# Altium project MiniSub_Power_Board.PrjPcb
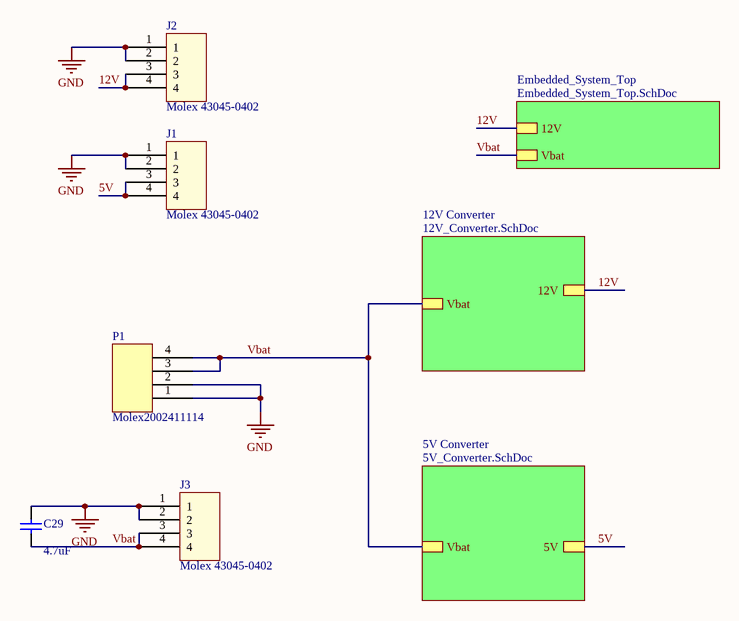
[diagram p0: MiniSub_Power_Board.SchDoc]
6 sheets, 96 parts. Net scope: hierarchical (ports join the sheet entries above them; power ports are global).
Board file: MiniSub_Power_Board.PcbDoc
Sheets:
  MiniSub_Power_Board.SchDoc
    12V Converter = 12V_Converter.SchDoc
    5V Converter = 5V_Converter.SchDoc
    Embedded_System_Top = Embedded_System_Top.SchDoc
      Embedded_Chip = Embedded_Chip.SchDoc
      Embedded Circuits = Embedded_Circuits.SchDoc

## Sheet MiniSub_Power_Board.SchDoc
size A

### Parts
C29  value 4.7uF  [C1210]  (hidden comment: HMK325C7475KN-TE)
J1  Molex 43045-0402  [Molex43045-0402]
J2  Molex 43045-0402  [Molex43045-0402]
J3  Molex 43045-0402  [Molex43045-0402]
P1  Molex2002411114  [Molex2002411114]

### Sub-sheets
5V Converter = 5V_Converter.SchDoc: Vbat, 5V
12V Converter = 12V_Converter.SchDoc: Vbat, 12V
Embedded_System_Top = Embedded_System_Top.SchDoc: 12V, Vbat

### Nets
GND: C29.2 J1.1 J1.2 J2.1 J2.2 J3.1 J3.2 P1.1 P1.2
5V: J1.3 J1.4 ; sheet 5V Converter/5V
12V: J2.3 J2.4 ; sheet 12V Converter/12V, sheet Embedded_System_Top/12V
Vbat: C29.1 J3.3 J3.4 P1.3 P1.4 ; sheet 12V Converter/Vbat, sheet 5V Converter/Vbat, sheet Embedded_System_Top/Vbat

### Library data of the parts
C29 = Cap Semi: Capacitor (Semiconductor SIM Model); Published: 8-Jun-2000; LatestRevisionDate: 29-May-2009; LatestRevisionNote: IPC-7351 Footprint Added.; PackageReference: C1206; Publisher: Altium Limited; PackageDescription: Chip Capacitor; ComponentLink1Description: Datasheet; ComponentLink1URL: https://www.yuden.co.jp/productdata/catalog/mlcc06_e.pdf; ComponentLink2Description: Digi-Key; ComponentLink2URL: https://www.digikey.com/product-detail/en/taiyo-yuden/HMK325C7475KN-TE/587-5038-1-ND/6563881
J1-J3 = Molex43045-0402: Micro-Fit 3.0 Right Angle Header, 3.00mm Pitch, Dual Row, 4 Circuits, with Snap-in Plastic Peg PCB Lock, Gold, Glow Wire Capable, Black; ComponentLink1Description: Molex Website; ComponentLink1URL: https://www.molex.com/molex/products/datasheet.jsp?part=active/0430450402_PCB_HEADERS.xml

## Sheet 12V_Converter.SchDoc
size A
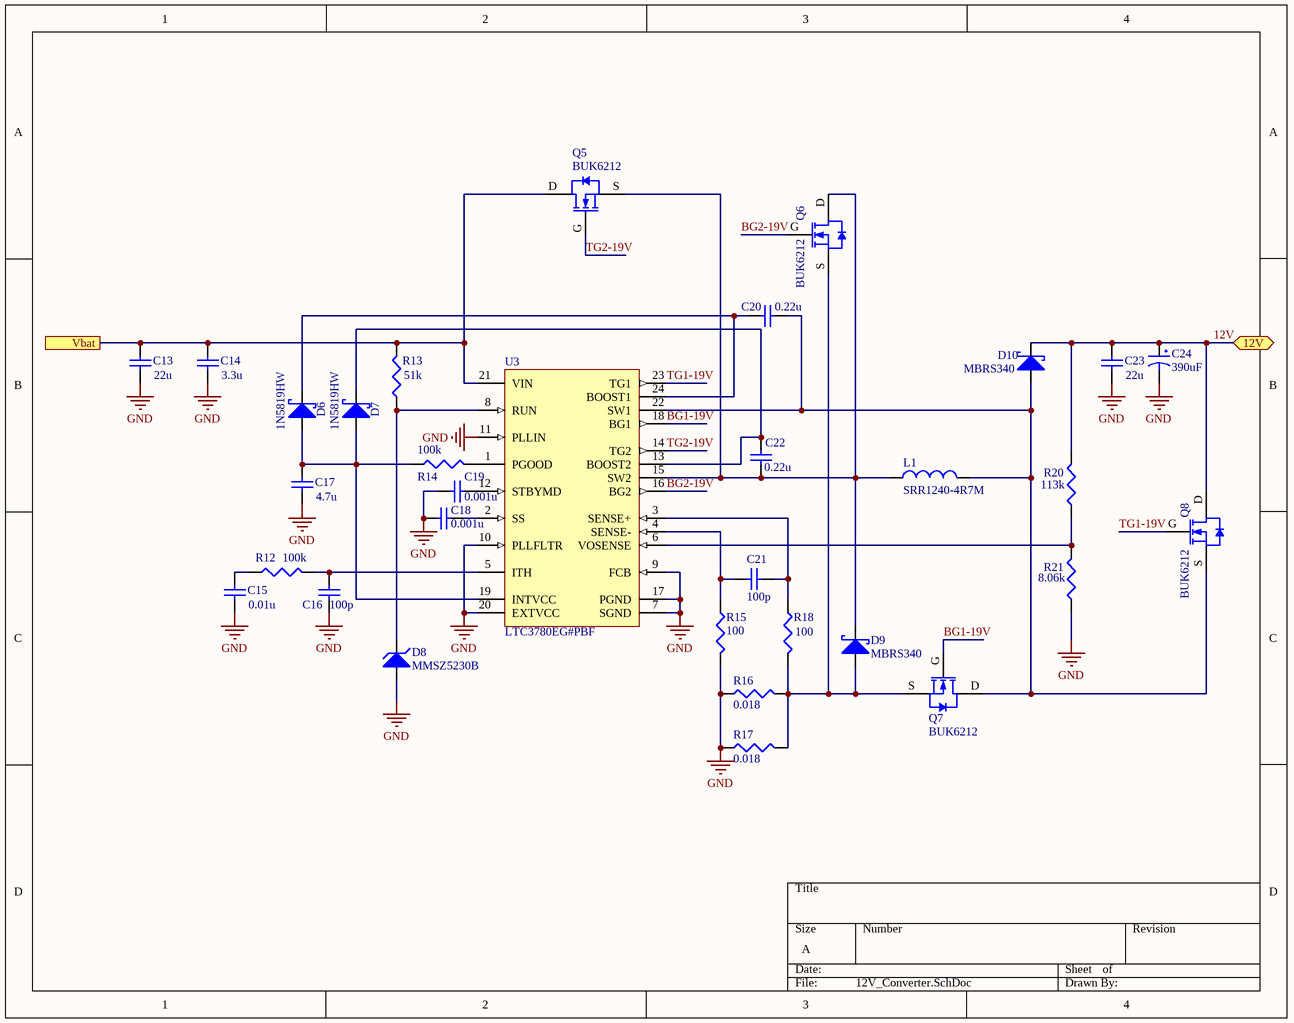
[diagram p1: 12V_Converter.SchDoc]

### Parts
C13  value 22u  [C1206]  (hidden comment: Cap Semi)
C14  value 3.3u  [C1206]  (hidden comment: Cap Semi)
C15  value 0.01u  [C1206]  (hidden comment: Cap Semi)
C16  value 100p  [C1206]  (hidden comment: Cap Semi)
C17  value 4.7u  [C1206]  (hidden comment: Cap Semi)
C18  value 0.001u  [C1206]  (hidden comment: Cap Semi)
C19  value 0.001u  [C1206]  (hidden comment: Cap Semi)
C20  value 0.22u  [C1206]  (hidden comment: Cap Semi)
C21  value 100p  [C1206]  (hidden comment: Cap Semi)
C22  value 0.22u  [C1206]  (hidden comment: Cap Semi)
C23  value 22u  [C1206]  (hidden comment: Cap Semi)
C24  390uF  [PCVxxxxxMCLxGS]
D6  1N5819HW  [1N58xx]
D7  1N5819HW  [1N58xx]
D8  MMSZ5230B  [ONSC-SOD-123-2-425-04_V]
D9  MBRS340  [MBRS340]
D10  MBRS340  [MBRS340]
L1  SRR1240-4R7M  [SRR1240]
Q5  BUK6212  [NXP-SOT428_M]
Q6  BUK6212  [NXP-SOT428_M]
Q7  BUK6212  [NXP-SOT428_M]
Q8  BUK6212  [NXP-SOT428_M]
R12  value 100k  [J1-0603]  (hidden comment: Res3)
R13  value 51k  [J1-0603]  (hidden comment: Res3)
R14  value 100k  [J1-0603]  (hidden comment: Res3)
R15  value 100  [J1-0603]  (hidden comment: Res3)
R16  value 0.018  [R1206]  (hidden comment: Res3)
R17  value 0.018  [R1206]  (hidden comment: Res3)
R18  value 100  [J1-0603]  (hidden comment: Res3)
R20  value 113k  [J1-0603]  (hidden comment: Res3)
R21  value 8.06k  [J1-0603]  (hidden comment: Res3)
U3  LTC3780EG#PBF  [LT-G-24_L]

### Ports
12V (bidir), Vbat

### Nets
GND: C13.1 C14.1 C15.1 C16.1 C17.1 C18.1 C19.1 C23.1 C24.2 D8.2(A) R15.2 R16.1 R17.1 R21.1 U3.7(SGND) U3.9(FCB) U3.10(PLLFLTR) U3.11(PLLIN) U3.17(PGND) U3.20(EXTVCC)
12V: C23.2 C24.1 D10.K(Cathode) Q8.D R20.2 ; port 12V
BG1-19V: Q7.G U3.18(BG1)
BG2-19V: Q6.G U3.16(BG2)
TG1-19V: Q8.G U3.23(TG1)
TG2-19V: Q5.G U3.14(TG2)
Vbat: C13.2 C14.2 Q5.D R13.2 U3.21(VIN) ; port Vbat
NetC15_2: C15.2 R12.1
NetC16_2: C16.2 R12.2 U3.5(ITH)
NetC17_2: C17.2 D6.A(Anode) D7.A(Anode) R14.1 U3.19(INTVCC)
NetC18_2: C18.2 U3.2(SS)
NetC19_2: C19.2 U3.12(STBYMD)
NetC20_1: C20.1 D10.A(Anode) L1.2 Q7.D Q8.S U3.22(SW1)
NetC20_2: C20.2 D6.K(Cathode) U3.24(BOOST1)
NetC21_1: C21.1 R15.1 U3.4(SENSE-)
NetC21_2: C21.2 R18.1 U3.3(SENSE+)
NetC22_1: C22.1 D9.K(Cathode) L1.1 Q5.S Q6.D U3.15(SW2)
NetC22_2: C22.2 D7.K(Cathode) U3.13(BOOST2)
NetD8_1: D8.1(K) R13.1 U3.8(RUN)
NetD9_A: D9.A(Anode) Q6.S Q7.S R16.2 R17.2 R18.2
NetR14_2: R14.2 U3.1(PGOOD)
NetR20_1: R20.1 R21.2 U3.6(VOSENSE)

### Library data of the parts
C13-C23 = Cap Semi: Capacitor (Semiconductor SIM Model); Published: 8-Jun-2000; LatestRevisionDate: 29-May-2009; LatestRevisionNote: IPC-7351 Footprint Added.; PackageReference: C1206; Publisher: Altium Limited; PackageDescription: Chip Capacitor
C24 = PCV1E391MCL2GS: CAP ALUM POLY 390UF 20% 25V SMD; Digikey: https://www.digikey.com/product-detail/en/nichicon/PCV1E391MCL2GS/493-4544-1-ND/2786841; Datasheet: http://nichicon-us.com/english/products/pdfs/e-pcv.pdf
D6 D7 = 1N58xx: 1A Schottky Barrier Rectifier Diode; Datasheet: http://www.kesenes.com/pdf/1n5817-1n5819.pdf
D8 = MMSZ5230BT1G: Zener Voltage Regulator, 500 mW, 2-Pin SOD-123, Pb-Free, Tape and Reel; Manufacturer: On Semiconductor; P Max (W): 0.5; VZ Typ (V): 4.7; DatasheetVersion: Rev. 12; PackageVersion: Rev. G, 10/2009; PackageReference: SOD-123-2-425-04; PackageDescription: 2-Pin SOD, Body 1.6 x 2.69 mm; Supplier 1: Digi-Key; Supplier Part Number 1: MMSZ5230BT1GOSTR-ND; Supplier 2: Digi-Key; Supplier Part Number 2: MMSZ5230BT1GOSCT-ND; Supplier 3: Digi-Key; Supplier Part Number 3: MMSZ5230BT1GOSDKR-ND; Supplier 4: Farnell; Supplier Part Number 4: 1431272; Supplier 5: Farnell; Supplier Part Number 5: 1431272RL; Supplier 6: Farnell; Supplier Part Number 6: 2370826; Supplier 7: Newark; Supplier Part Number 7: 83H7423; Supplier 8: Newark; Supplier Part Number 8: 67R1368; Supplier 9: Mouser; Supplier Part Number 9: 863-MMSZ5230BT1G; Packing: Tape and Reel; RoHS: Pb-Free; Mounting Technology: Surface Mount; PartNumber: MMSZ5230BT1G; ComponentLink1Description: Manufacturer URL; ComponentLink1URL: http://www.onsemi.com/; ComponentLink2Description: Datasheet; ComponentLink2URL: http://www.onsemi.com/pub_link/Collateral/MMSZ5221BT1-D.PDF; ComponentLink3Description: Package Specification; ComponentLink3URL: http://www.onsemi.com/pub_link/Collateral/425-04.PDF
D9 D10 = MBRS340: Schottky Rectifier; Datasheet: https://www.mouser.com/ds/2/308/MBRS340-1120985.pdf
L1 = SRR1240: FIXED IND 4.7UH 6A 18 MOHM SMD; Digikey: https://www.digikey.com/product-detail/en/bourns-inc/SRR1240-4R7M/SRR1240-4R7MCT-ND/2127398; Datasheet: https://www.bourns.com/docs/Product-Datasheets/SRR1240.pdf
Q5-Q8 = BUK6212: N-Channel TrenchMOS Intermediate Level FET, 40 V, 50 A, 3-Pin SOT428, Tape and Reel; Manufacturer: NXP Semiconductors; PartNumber: BUK6212-40C,118; Automotive Qualified: Y; Channel Type: N; ID [max] (A): 50; IDM [max] (A): 233; Packing: Tape & Reel; Qr [typ] (nC): 38; VDS [max] (V): 40; VGSth [typ] (V): 2.3; DatasheetVersion: Rev. 2; PackageVersion: 14-06-10, 06/2014; PackageReference: SOT428; PackageDescription: 3-Pin Plastic Single-ended Surface Mounted Package, Body 6.1 x 6.6 mm, Pitch 2.285 mm; Supplier 1: Digi-Key; Supplier Part Number 1: 568-6983-2-ND; Supplier 2: Digi-Key; Supplier Part Number 2: 568-6983-1-ND; Supplier 3: Digi-Key; Supplier Part Number 3: 568-6983-6-ND; Supplier 4: Mouser; Supplier Part Number 4: 771-BUK621240C118; Mounting Technology: Surface Mount; Code_JEITA: SC-63; Code_JEDEC: TO-252; ComponentLink1Description: Manufacturer URL; ComponentLink1URL: http://www.nxp.com/; ComponentLink2Description: Datasheet; ComponentLink2URL: http://www.nxp.com/documents/data_sheet/BUK6212-40C.pdf; ComponentLink3Description: Package Specification; ComponentLink3URL: http://www.nxp.com/documents/outline_drawing/sot428_po.pdf
R12-R18 R20 R21 = Res3: Resistor; Published: 8-Jun-2000; LatestRevisionDate: 29-May-2009; LatestRevisionNote: IPC-7351 Footprint Added.; PackageReference: J1-0603; Publisher: Altium Limited; PackageDescription: Chip Resistor
U3 = LTC3780EG#PBF: Buck-boost Controller, Constant Frequency, Current Mode Control with Power Good Output, 24-pin SOP (G-24), -40 to 85 degC, Pb-Free; Manufacturer: Linear Technology; Frequency Sync Range: 200kHz - 400kHz; Number of Outputs: 1; DatasheetVersion: Rev. F; PackageVersion: Jun-10; PackageReference: G-24; PackageDescription: 24-Pin Plastic SSOP, Body 8.2 x 5.3 mm, Pitch 0.65 mm; Supplier 1: Digi-Key; Supplier Part Number 1: LTC3780EG#PBF-ND; Supplier 2: Farnell; Supplier Part Number 2: 1273545; Supplier 3: Newark; Supplier Part Number 3: 56M8395; RoHS: TRUE; Mounting Technology: Surface Mount; PartNumber: LTC3780EG#PBF; ComponentLink1Description: Manufacturer URL; ComponentLink1URL: http://www.linear.com/; ComponentLink2Description: Datasheet; ComponentLink2URL: http://cds.linear.com/docs/en/datasheet/3780ff.pdf; ComponentLink3Description: Package Specification; ComponentLink3URL: http://cds.linear.com/docs/en/packaging/SSOP_24_05-08-1640.pdf

## Sheet 5V_Converter.SchDoc
size A
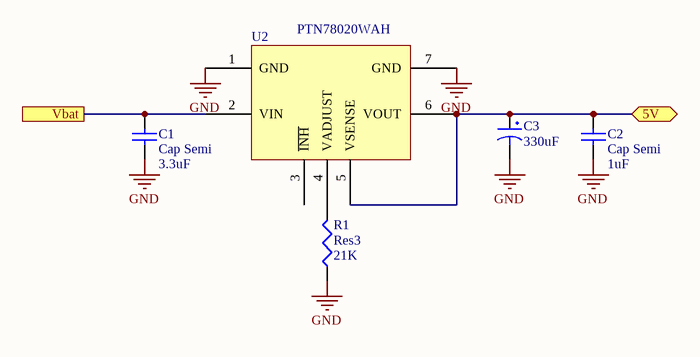
[diagram p2: 5V_Converter.SchDoc]

### Parts
C1  Cap Semi  value 3.3uF  [C1206]
C2  Cap Semi  value 1uF  [C1206]
C3  330uF  [PCVxxxxxMCLxGS]
R1  Res3  value 21K  [J1-0603]
U2  PTN78020WAH  [PTN78020WAH]

### Ports
5V (bidir), Vbat

### Nets
GND: C1.1 C2.1 C3.2 R1.1 U2.1(GND) U2.7(GND)
5V: C2.2 C3.1 U2.5(VSENSE) U2.6(VOUT) ; port 5V
Vbat: C1.2 U2.2(VIN) ; port Vbat
NetR1_2: R1.2 U2.4(VADJUST)

Not connected (* = marked no-connect by the designer): U2 3(~{INH})

### Library data of the parts
C1 C2 = Cap Semi: Capacitor (Semiconductor SIM Model); Published: 8-Jun-2000; LatestRevisionDate: 29-May-2009; LatestRevisionNote: IPC-7351 Footprint Added.; PackageReference: C1206; Publisher: Altium Limited; PackageDescription: Chip Capacitor
C3 = PCV1E391MCL2GS: CAP ALUM POLY 390UF 20% 25V SMD; Digikey: https://www.digikey.com/product-detail/en/nichicon/PCV1E391MCL2GS/493-4544-1-ND/2786841; Datasheet: http://nichicon-us.com/english/products/pdfs/e-pcv.pdf
R1 = Res3: Resistor; Published: 8-Jun-2000; LatestRevisionDate: 29-May-2009; LatestRevisionNote: IPC-7351 Footprint Added.; PackageReference: J1-0603; Publisher: Altium Limited; PackageDescription: Chip Resistor
U2 = PTN78020WAH: 6A DC DC Converter

## Sheet Embedded_System_Top.SchDoc
size A
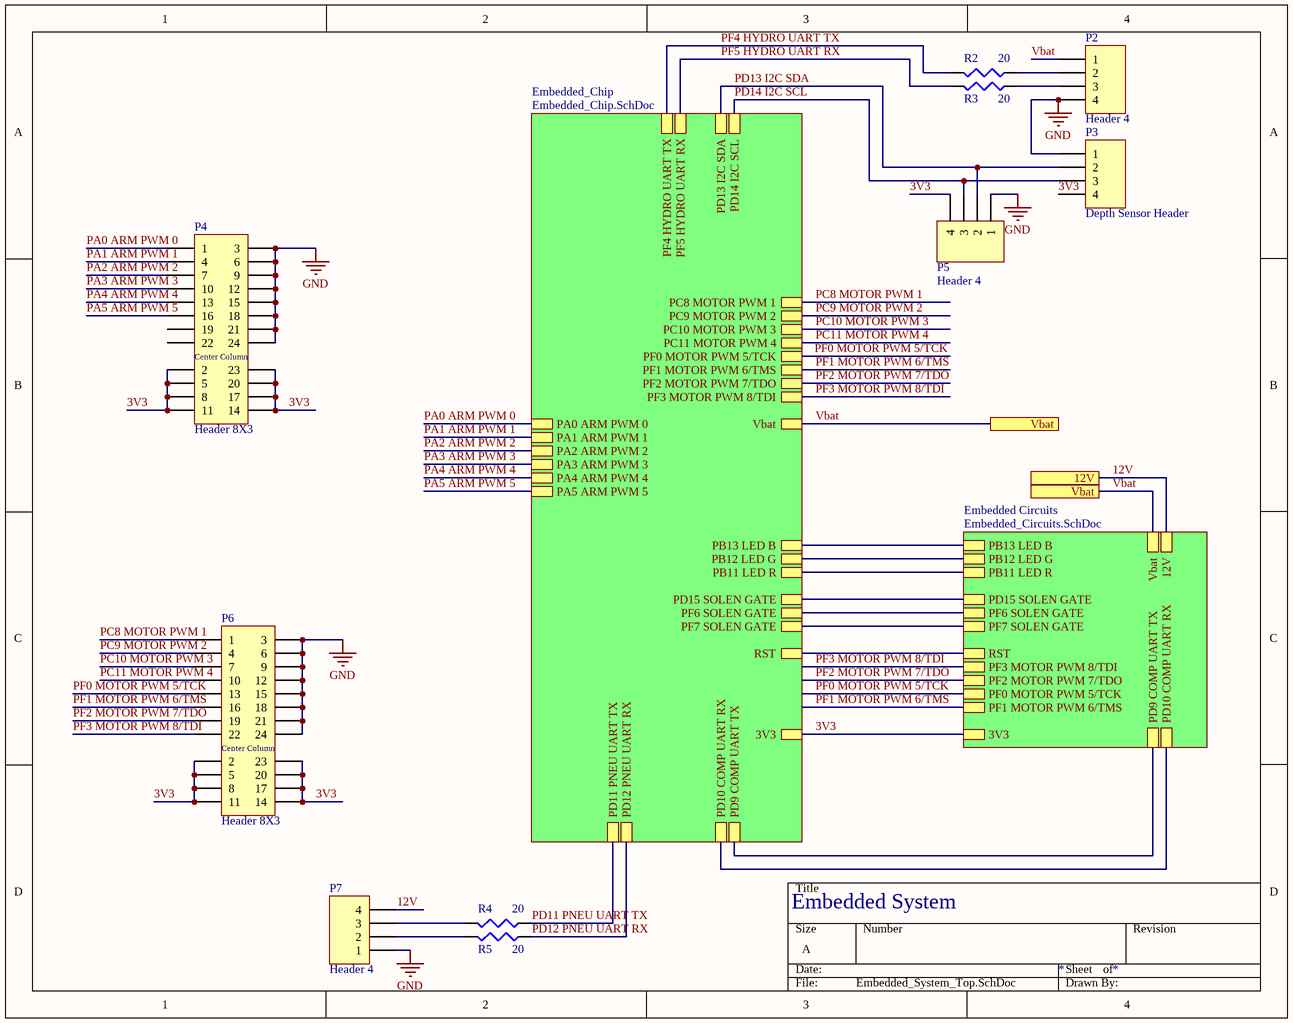
[diagram p3: Embedded_System_Top.SchDoc]

### Parts
P2  Header 4  [Header 1x4]
P3  Depth Sensor Header  [DF13-4P-1.25DSA]
P4  Header 8X3  [Header 8X3]
P5  Header 4  [DF13-4P-1.25DSA]
P6  Header 8X3  [Header 8X3]
P7  Header 4  [Header 1x4]
R2  value 20  [J1-0603]  (hidden comment: Res3)
R3  value 20  [J1-0603]  (hidden comment: Res3)
R4  value 20  [J1-0603]  (hidden comment: Res3)
R5  value 20  [J1-0603]  (hidden comment: Res3)

### Sub-sheets
Embedded Circuits = Embedded_Circuits.SchDoc: 3V3, RST, PB11 LED R, PB12 LED G, PB13 LED B, PF3 MOTOR PWM 8/TDI, PF2 MOTOR PWM 7/TDO, PF0 MOTOR PWM 5/TCK, PF1 MOTOR PWM 6/TMS, PD10 COMP UART RX, PD9 COMP UART TX, Vbat, 12V, PD15 SOLEN GATE, PF6 SOLEN GATE, PF7 SOLEN GATE
Embedded_Chip = Embedded_Chip.SchDoc: 3V3, RST, PB11 LED R, PB13 LED B, PB12 LED G, PD10 COMP UART RX, PD9 COMP UART TX, Vbat, PF3 MOTOR PWM 8/TDI, PF2 MOTOR PWM 7/TDO, PF1 MOTOR PWM 6/TMS, PF0 MOTOR PWM 5/TCK, PC11 MOTOR PWM 4, PC10 MOTOR PWM 3, PC9 MOTOR PWM 2, PC8 MOTOR PWM 1, PF5 HYDRO UART RX, PF4 HYDRO UART TX, PD11 PNEU UART TX, PD12 PNEU UART RX, PA3 ARM PWM 3, PA1 ARM PWM 1, PA2 ARM PWM 2, PA0 ARM PWM 0, PA4 ARM PWM 4, PA5 ARM PWM 5, PD13 I2C SDA, PD14 I2C SCL, PD15 SOLEN GATE, PF6 SOLEN GATE, PF7 SOLEN GATE

### Ports
12V, Vbat

### Nets
GND: P2.4 P3.1 P4.3 P4.6 P4.9 P4.12 P4.15 P4.18 P4.21 P4.24 P5.1 P6.3 P6.6 P6.9 P6.12 P6.15 P6.18 P6.21 P6.24 P7.1
3V3: P3.4 P4.2 P4.5 P4.8 P4.11 P4.14 P4.17 P4.20 P4.23 P5.4 P6.2 P6.5 P6.8 P6.11 P6.14 P6.17 P6.20 P6.23 ; sheet Embedded_Chip/3V3, sheet Embedded Circuits/3V3
12V: P7.4 ; port 12V, sheet Embedded Circuits/12V
PA0 ARM PWM 0: P4.1 ; sheet Embedded_Chip/PA0 ARM PWM 0
PA1 ARM PWM 1: P4.4 ; sheet Embedded_Chip/PA1 ARM PWM 1
PA2 ARM PWM 2: P4.7 ; sheet Embedded_Chip/PA2 ARM PWM 2
PA3 ARM PWM 3: P4.10 ; sheet Embedded_Chip/PA3 ARM PWM 3
PA4 ARM PWM 4: P4.13 ; sheet Embedded_Chip/PA4 ARM PWM 4
PA5 ARM PWM 5: P4.16 ; sheet Embedded_Chip/PA5 ARM PWM 5
PB11 LED R: sheet Embedded_Chip/PB11 LED R, sheet Embedded Circuits/PB11 LED R
PB12 LED G: sheet Embedded_Chip/PB12 LED G, sheet Embedded Circuits/PB12 LED G
PB13 LED B: sheet Embedded_Chip/PB13 LED B, sheet Embedded Circuits/PB13 LED B
PC8 MOTOR PWM 1: P6.1 ; sheet Embedded_Chip/PC8 MOTOR PWM 1
PC9 MOTOR PWM 2: P6.4 ; sheet Embedded_Chip/PC9 MOTOR PWM 2
PC10 MOTOR PWM 3: P6.7 ; sheet Embedded_Chip/PC10 MOTOR PWM 3
PC11 MOTOR PWM 4: P6.10 ; sheet Embedded_Chip/PC11 MOTOR PWM 4
PD11 PNEU UART TX: R4.1 ; sheet Embedded_Chip/PD11 PNEU UART TX
PD12 PNEU UART RX: R5.1 ; sheet Embedded_Chip/PD12 PNEU UART RX
PD13 I2C SDA: P3.2 P5.2 ; sheet Embedded_Chip/PD13 I2C SDA
PD14 I2C SCL: P3.3 P5.3 ; sheet Embedded_Chip/PD14 I2C SCL
PF0 MOTOR PWM 5/TCK: P6.13 ; sheet Embedded_Chip/PF0 MOTOR PWM 5/TCK, sheet Embedded Circuits/PF0 MOTOR PWM 5/TCK
PF1 MOTOR PWM 6/TMS: P6.16 ; sheet Embedded_Chip/PF1 MOTOR PWM 6/TMS, sheet Embedded Circuits/PF1 MOTOR PWM 6/TMS
PF2 MOTOR PWM 7/TDO: P6.19 ; sheet Embedded_Chip/PF2 MOTOR PWM 7/TDO, sheet Embedded Circuits/PF2 MOTOR PWM 7/TDO
PF3 MOTOR PWM 8/TDI: P6.22 ; sheet Embedded_Chip/PF3 MOTOR PWM 8/TDI, sheet Embedded Circuits/PF3 MOTOR PWM 8/TDI
PF4 HYDRO UART TX: R2.2 ; sheet Embedded_Chip/PF4 HYDRO UART TX
PF5 HYDRO UART RX: R3.2 ; sheet Embedded_Chip/PF5 HYDRO UART RX
RST: sheet Embedded_Chip/RST, sheet Embedded Circuits/RST
Vbat: P2.1 ; port Vbat, sheet Embedded_Chip/Vbat, sheet Embedded Circuits/Vbat
NetP2_2: P2.2 R2.1
NetP2_3: P2.3 R3.1
NetP7_2: P7.2 R5.2
NetP7_3: P7.3 R4.2
NetR23_1: sheet Embedded_Chip/PD15 SOLEN GATE, sheet Embedded Circuits/PD15 SOLEN GATE
NetR25_1: sheet Embedded_Chip/PF6 SOLEN GATE, sheet Embedded Circuits/PF6 SOLEN GATE
NetR27_1: sheet Embedded_Chip/PF7 SOLEN GATE, sheet Embedded Circuits/PF7 SOLEN GATE
NetU1_18: sheet Embedded_Chip/PD9 COMP UART TX, sheet Embedded Circuits/PD9 COMP UART TX
NetU1_19: sheet Embedded_Chip/PD10 COMP UART RX, sheet Embedded Circuits/PD10 COMP UART RX

Not connected (* = marked no-connect by the designer): P4 19 22

### Notes on the sheet
- Embedded System
- (in symbol Header 8X3 (2mm)) Center Column

### Library data of the parts
P2 P3 P5 P7 = Header 4: Header, 4-Pin; LatestRevisionDate: 17-Jul-2002; LatestRevisionNote: Re-released for DXP Platform.; Publisher: Altium Limited
P4 P6 = Header 8X3 (2mm): Connector Header Through Hole 24 position 0.079" (2.00mm); Digikey: https://www.digikey.com/product-detail/en/samtec-inc/TMMH-108-01-T-T/SAM12190-ND/6692344; Drawing: http://suddendocs.samtec.com/prints/tmmh-1xx-xx-xx-x-xxx-mkt.pdf
R2-R5 = Res3: Resistor; Published: 8-Jun-2000; LatestRevisionDate: 29-May-2009; LatestRevisionNote: IPC-7351 Footprint Added.; PackageReference: J1-0603; Publisher: Altium Limited; PackageDescription: Chip Resistor

## Sheet Embedded_Chip.SchDoc
size A
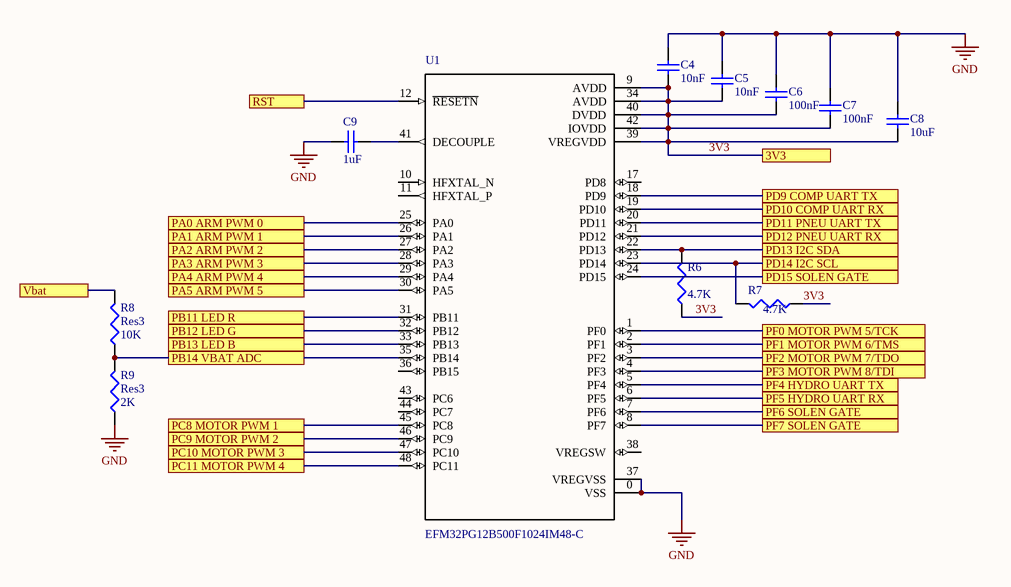
[diagram p4: Embedded_Chip.SchDoc]

### Parts
C4  value 10nF  [C1206]  (hidden comment: Cap Semi)
C5  value 10nF  [C1206]  (hidden comment: Cap Semi)
C6  value 100nF  [C1206]  (hidden comment: Cap Semi)
C7  value 100nF  [C1206]  (hidden comment: Cap Semi)
C8  value 10uF  [C1206]  (hidden comment: Cap Semi)
C9  value 1uF  [C1206]  (hidden comment: Cap Semi)
R6  value 4.7K  [J1-0603]  (hidden comment: Res3)
R7  value 4.7K  [J1-0603]  (hidden comment: Res3)
R8  Res3  value 10K  [J1-0603]
R9  Res3  value 2K  [J1-0603]
U1  EFM32PG12B500F1024IM48-C  [QFN50P700X700X90-49N]

### Ports
3V3, PA0 ARM PWM 0, PA1 ARM PWM 1, PA2 ARM PWM 2, PA3 ARM PWM 3, PA4 ARM PWM 4, PA5 ARM PWM 5, PB11 LED R, PB12 LED G, PB13 LED B, PB14 VBAT ADC, PC8 MOTOR PWM 1, PC9 MOTOR PWM 2, PC10 MOTOR PWM 3, PC11 MOTOR PWM 4, PD9 COMP UART TX, PD10 COMP UART RX, PD11 PNEU UART TX, PD12 PNEU UART RX, PD13 I2C SDA, PD14 I2C SCL, PD15 SOLEN GATE, PF0 MOTOR PWM 5/TCK, PF1 MOTOR PWM 6/TMS, PF2 MOTOR PWM 7/TDO, PF3 MOTOR PWM 8/TDI, PF4 HYDRO UART TX, PF5 HYDRO UART RX, PF6 SOLEN GATE, PF7 SOLEN GATE, RST, Vbat

### Nets
GND: C4.1 C5.1 C6.1 C7.1 C8.1 C9.2 R9.1 U1.0(VSS) U1.37(VREGVSS)
3V3: C4.2 C5.2 C6.2 C7.2 C8.2 R6.1 R7.1 U1.9(AVDD) U1.34(AVDD) U1.39(VREGVDD) U1.40(DVDD) U1.42(IOVDD) ; port 3V3
PA0 ARM PWM 0: U1.25(PA0) ; port PA0 ARM PWM 0
PA1 ARM PWM 1: U1.26(PA1) ; port PA1 ARM PWM 1
PA2 ARM PWM 2: U1.27(PA2) ; port PA2 ARM PWM 2
PA3 ARM PWM 3: U1.28(PA3) ; port PA3 ARM PWM 3
PA4 ARM PWM 4: U1.29(PA4) ; port PA4 ARM PWM 4
PA5 ARM PWM 5: U1.30(PA5) ; port PA5 ARM PWM 5
PB11 LED R: U1.31(PB11) ; port PB11 LED R
PB12 LED G: U1.32(PB12) ; port PB12 LED G
PB13 LED B: U1.33(PB13) ; port PB13 LED B
PC8 MOTOR PWM 1: U1.45(PC8) ; port PC8 MOTOR PWM 1
PC9 MOTOR PWM 2: U1.46(PC9) ; port PC9 MOTOR PWM 2
PC10 MOTOR PWM 3: U1.47(PC10) ; port PC10 MOTOR PWM 3
PC11 MOTOR PWM 4: U1.48(PC11) ; port PC11 MOTOR PWM 4
PD11 PNEU UART TX: U1.20(PD11) ; port PD11 PNEU UART TX
PD12 PNEU UART RX: U1.21(PD12) ; port PD12 PNEU UART RX
PD13 I2C SDA: R6.2 U1.22(PD13) ; port PD13 I2C SDA
PD14 I2C SCL: R7.2 U1.23(PD14) ; port PD14 I2C SCL
PF0 MOTOR PWM 5/TCK: U1.1(PF0) ; port PF0 MOTOR PWM 5/TCK
PF1 MOTOR PWM 6/TMS: U1.2(PF1) ; port PF1 MOTOR PWM 6/TMS
PF2 MOTOR PWM 7/TDO: U1.3(PF2) ; port PF2 MOTOR PWM 7/TDO
PF3 MOTOR PWM 8/TDI: U1.4(PF3) ; port PF3 MOTOR PWM 8/TDI
PF4 HYDRO UART TX: U1.5(PF4) ; port PF4 HYDRO UART TX
PF5 HYDRO UART RX: U1.6(PF5) ; port PF5 HYDRO UART RX
RST: U1.12(~{RESETN}) ; port RST
Vbat: R8.2 ; port Vbat
NetC9_1: C9.1 U1.41(DECOUPLE)
NetR8_1: R8.1 R9.2 U1.35(PB14) ; port PB14 VBAT ADC
NetR23_1: U1.24(PD15) ; port PD15 SOLEN GATE
NetR25_1: U1.7(PF6) ; port PF6 SOLEN GATE
NetR27_1: U1.8(PF7) ; port PF7 SOLEN GATE
NetU1_18: U1.18(PD9) ; port PD9 COMP UART TX
NetU1_19: U1.19(PD10) ; port PD10 COMP UART RX

Not connected (* = marked no-connect by the designer): U1 10(HFXTAL_N) 11(HFXTAL_P) 17(PD8) 36(PB15) 38(VREGSW) 43(PC6) 44(PC7)

### Library data of the parts
C4-C9 = Cap Semi: Capacitor (Semiconductor SIM Model); Published: 8-Jun-2000; LatestRevisionDate: 29-May-2009; LatestRevisionNote: IPC-7351 Footprint Added.; PackageReference: C1206; Publisher: Altium Limited; PackageDescription: Chip Capacitor
R6-R9 = Res3: Resistor; Published: 8-Jun-2000; LatestRevisionDate: 29-May-2009; LatestRevisionNote: IPC-7351 Footprint Added.; PackageReference: J1-0603; Publisher: Altium Limited; PackageDescription: Chip Resistor
U1 = EFM32PG12B500F1024IM48-C: ARM® Cortex®-M4 Pearl Gecko Microcontroller IC 32-Bit 40MHz 1MB (1M x 8) FLASH 48-QFN (7x7); MP: EFM32PG12B500F1024GM48-B; MF: Silicon Labs; Package: QFN-48 Silicon Labs; Price: None; Availability: Unavailable; SnapEDA_Link: https://www.snapeda.com/parts/EFM32PG12B500F1024GM48-B/Silicon%20Labs/view-part/?ref=snap; Value: *; ComponentLink1Description: Digi-Key; ComponentLink1URL: https://www.digikey.com/product-detail/en/silicon-labs/EFM32PG12B500F1024IM48-C/336-5333-ND/8161157

## Sheet Embedded_Circuits.SchDoc
size A
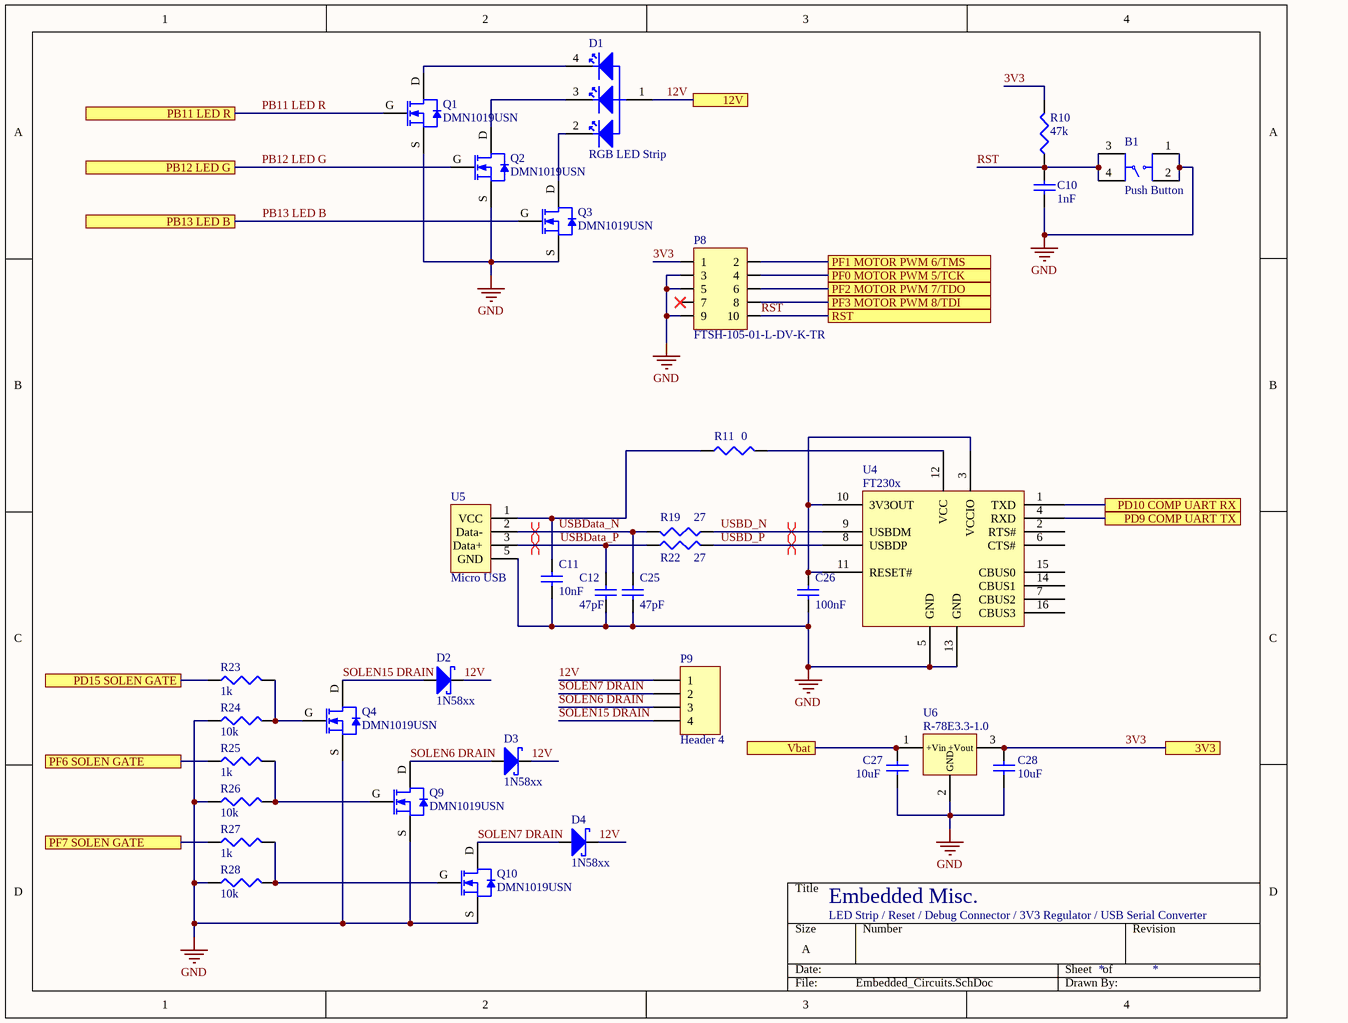
[diagram p5: Embedded_Circuits.SchDoc]

### Parts
B1  Push Button  [Push Button]
C10  value 1nF  [C1206]  (hidden comment: Cap Semi)
C11  value 10nF  [C1206]  (hidden comment: Cap)
C12  value 47pF  [C1206]  (hidden comment: Cap)
C25  value 47pF  [C1206]  (hidden comment: Cap)
C26  value 100nF  [C1206]  (hidden comment: Cap)
C27  value 10uF  [C1206]  (hidden comment: Cap)
C28  value 10uF  [C1206]  (hidden comment: Cap)
D1  RGB LED Strip  [Header 1x4]
D2  1N58xx  [1N58xx]
D3  1N58xx  [1N58xx]
D4  1N58xx  [1N58xx]
P8  FTSH-105-01-L-DV-K-TR  [FTSH-105-01-L-DV-K-TR]
P9  Header 4  [HDR1X4]
Q1  DMN1019USN  [SOT-23]
Q2  DMN1019USN  [SOT-23]
Q3  DMN1019USN  [SOT-23]
Q4  DMN1019USN  [SOT-23]
Q9  DMN1019USN  [SOT-23]
Q10  DMN1019USN  [SOT-23]
R10  value 47k  [J1-0603]  (hidden comment: Res3)
R11  value 0  [J1-0603]  (hidden comment: Res3)
R19  value 27  [J1-0603]  (hidden comment: Res3)
R22  value 27  [J1-0603]  (hidden comment: Res3)
R23  value 1k  [J1-0603]  (hidden comment: Res3)
R24  value 10k  [J1-0603]  (hidden comment: Res3)
R25  value 1k  [J1-0603]  (hidden comment: Res3)
R26  value 10k  [J1-0603]  (hidden comment: Res3)
R27  value 1k  [J1-0603]  (hidden comment: Res3)
R28  value 10k  [J1-0603]  (hidden comment: Res3)
U4  FT230x  [FT230X]
U5  Micro USB  [Micro USB]
U6  R-78E3.3-1.0  [R-78Exx-1.0]

### Ports
3V3, 12V, PB11 LED R, PB12 LED G, PB13 LED B, PD9 COMP UART TX, PD10 COMP UART RX, PD15 SOLEN GATE, PF0 MOTOR PWM 5/TCK, PF1 MOTOR PWM 6/TMS, PF2 MOTOR PWM 7/TDO, PF3 MOTOR PWM 8/TDI, PF6 SOLEN GATE, PF7 SOLEN GATE, RST, Vbat

### Nets
GND: B1.1 B1.2 C10.1 C11.1 C12.1 C25.1 C26.1 C27.1 C28.1 P8.3 P8.5 P8.9 Q1.S Q2.S Q3.S Q4.S Q9.S Q10.S R24.1 R26.1 R28.1 U4.5(GND) U4.13(GND) U5.5(GND) U6.2(GND)
3V3: C28.2 P8.1 R10.2 U6.3(+Vout) ; port 3V3
12V: D1.1 D2.K(Cathode) D3.K(Cathode) D4.K(Cathode) P9.1 ; port 12V
PB11 LED R: Q1.G ; port PB11 LED R
PB12 LED G: Q2.G ; port PB12 LED G
PB13 LED B: Q3.G ; port PB13 LED B
PF0 MOTOR PWM 5/TCK: P8.4 ; port PF0 MOTOR PWM 5/TCK
PF1 MOTOR PWM 6/TMS: P8.2 ; port PF1 MOTOR PWM 6/TMS
PF2 MOTOR PWM 7/TDO: P8.6 ; port PF2 MOTOR PWM 7/TDO
PF3 MOTOR PWM 8/TDI: P8.8 ; port PF3 MOTOR PWM 8/TDI
RST: B1.3 B1.4 C10.2 P8.10 R10.1 ; port RST
SOLEN6 DRAIN: D3.A(Anode) P9.3 Q9.D
SOLEN7 DRAIN: D4.A(Anode) P9.2 Q10.D
SOLEN15 DRAIN: D2.A(Anode) P9.4 Q4.D
USBD_N: R19.1 U4.9(USBDM)
USBD_P: R22.2 U4.8(USBDP)
USBData_N: C25.2 R19.2 U5.2(Data-)
USBData_P: C12.2 R22.1 U5.3(Data+)
Vbat: C27.2 U6.1(+Vin) ; port Vbat
NetC11_2: C11.2 R11.1 U5.1(VCC)
NetC26_2: C26.2 U4.3(VCCIO) U4.10(3V3OUT) U4.11(RESET#)
NetD1_2: D1.2 Q3.D
NetD1_3: D1.3 Q2.D
NetD1_4: D1.4 Q1.D
NetQ4_G: Q4.G R23.2 R24.2
NetQ9_G: Q9.G R25.2 R26.2
NetQ10_G: Q10.G R27.2 R28.2
NetR11_2: R11.2 U4.12(VCC)
NetR23_1: R23.1 ; port PD15 SOLEN GATE
NetR25_1: R25.1 ; port PF6 SOLEN GATE
NetR27_1: R27.1 ; port PF7 SOLEN GATE
NetU1_18: U4.4(RXD) ; port PD9 COMP UART TX
NetU1_19: U4.1(TXD) ; port PD10 COMP UART RX

Not connected (* = marked no-connect by the designer): P8 7*; U4 2(RTS#) 6(CTS#) 7(CBUS2) 14(CBUS1) 15(CBUS0) 16(CBUS3)

### Layout directives
differential pair: USBD_N, USBD_P, USBData_N, USBData_P

### Notes on the sheet
- Embedded Misc.
- LED Strip / Reset / Debug Connector / 3V3 Regulator / USB Serial Converter

### Library data of the parts
B1 = Push Button: Tactile Switch SPST-NO Top Actuated Through Hole; Digikey Link: https://www.digikey.com/product-detail/en/te-connectivity-alcoswitch-switches/FSM101/450-1157-ND/701084; Drawing: https://www.te.com/commerce/DocumentDelivery/DDEController?Action=srchrtrv&DocNm=1571140&DocType=Customer+Drawing&DocLang=English
C10 = Cap Semi: Capacitor (Semiconductor SIM Model); Published: 8-Jun-2000; LatestRevisionDate: 29-May-2009; LatestRevisionNote: IPC-7351 Footprint Added.; PackageReference: C1206; Publisher: Altium Limited; PackageDescription: Chip Capacitor; Supplier 1: Digi-Key; Supplier Part Number 1: 490-4761-1-ND
C11 C12 C25-C28 = Cap: Capacitor; Published: 8-Jun-2000; LatestRevisionDate: 17-Jul-2002; LatestRevisionNote: Re-released for DXP Platform.; PackageReference: RAD-0.3; Publisher: Altium Limited; PackageDescription: Radial Cap, Thru-Hole; 2 Leads; 0.3 in Pin Spacing; Supplier 1: Digi-Key
  C11: Supplier Part Number 1: 1276-1921-1-ND
  C12 C25: Supplier Part Number 1: 490-16375-1-ND
  C26: Supplier Part Number 1: 1276-1001-1-ND
  C27 C28: Supplier Part Number 1: 1276-2872-1-ND
D1 = RGB LED Strip: LED RGB Strip - Bare Nonaddressable; Sparkfun Link: https://www.sparkfun.com/products/12021
D2-D4 = 1N58xx: 1A Schottky Barrier Rectifier Diode; Datasheet: http://www.kesenes.com/pdf/1n5817-1n5819.pdf; Digikey: https://www.digikey.com/product-detail/en/comchip-technology/SS24-HF/641-SS24-HFCT-ND/10443817
P8 = JTAG Header: CONN HEADER 10POS DUAL .05" SMD; Digikey Link: https://www.digikey.com/product-detail/en/samtec-inc/FTSH-105-01-L-DV-K-TR/SAM13165CT-ND/8827920; Drawings: http://suddendocs.samtec.com/prints/ftsh-1xx-xx-xxx-dv-xxx-xxx-mkt.pdf; Datasheet: http://suddendocs.samtec.com/catalog_english/ftsh_smt.pdf
P9 = Header 4: Header, 4-Pin; LatestRevisionDate: 17-Jul-2002; LatestRevisionNote: Re-released for DXP Platform.; Publisher: Altium Limited
Q1-Q4 Q9 Q10 = DMN1019USN: 12V N-Channel Enhancement Mode MOSFET; Datasheet: https://www.diodes.com/assets/Datasheets/DMN1019USN.pdf; Digikey: https://www.digikey.com/product-detail/en/diodes-incorporated/DMN1019USN-13/DMN1019USN-13DICT-ND/4898885
R10 R11 R19 R22-R28 = Res3: Resistor; Published: 8-Jun-2000; LatestRevisionDate: 29-May-2009; LatestRevisionNote: IPC-7351 Footprint Added.; PackageReference: J1-0603; Publisher: Altium Limited; PackageDescription: Chip Resistor
U4 = FTDI FT230x: USB to Basic UART IC; Datasheet: https://www.ftdichip.com/Support/Documents/DataSheets/ICs/DS_FT230X.pdf
U5 = Micro USB: USB - micro B USB 2.0 Receptacle Connector 5 Position Surface Mount, Right Angle; Digikey: https://www.digikey.com/product-detail/en/molex-llc/1050170001/WM1399CT-ND/2350885; Datasheet: https://www.molex.com/pdm_docs/sd/1050170001_sd.pdf
U6 = R-78Exx-1.0: 1A DC/DC Voltage Converter; Datasheet: https://www.recom-power.com/pdf/Innoline/R-78Exx-0.5.pdf

## Nets that join several sheets
GND: MiniSub_Power_Board (9 pins), 12V_Converter (20 pins), 5V_Converter (6 pins), Embedded_System_Top (20 pins), Embedded_Chip (9 pins), Embedded_Circuits (25 pins)
3V3: Embedded_System_Top (18 pins), Embedded_Chip (12 pins), Embedded_Circuits (C28.2 P8.1 R10.2 U6.3)
5V: MiniSub_Power_Board (J1.3 J1.4), 5V_Converter (C2.2 C3.1 U2.5 U2.6)
12V: MiniSub_Power_Board (J2.3 J2.4), 12V_Converter (5 pins), Embedded_System_Top (P7.4), Embedded_Circuits (5 pins)
NetR23_1: Embedded_Chip (U1.24), Embedded_Circuits (R23.1)
NetR25_1: Embedded_Chip (U1.7), Embedded_Circuits (R25.1)
NetR27_1: Embedded_Chip (U1.8), Embedded_Circuits (R27.1)
NetU1_18: Embedded_Chip (U1.18), Embedded_Circuits (U4.4)
NetU1_19: Embedded_Chip (U1.19), Embedded_Circuits (U4.1)
PA0 ARM PWM 0: Embedded_System_Top (P4.1), Embedded_Chip (U1.25)
PA1 ARM PWM 1: Embedded_System_Top (P4.4), Embedded_Chip (U1.26)
PA2 ARM PWM 2: Embedded_System_Top (P4.7), Embedded_Chip (U1.27)
PA3 ARM PWM 3: Embedded_System_Top (P4.10), Embedded_Chip (U1.28)
PA4 ARM PWM 4: Embedded_System_Top (P4.13), Embedded_Chip (U1.29)
PA5 ARM PWM 5: Embedded_System_Top (P4.16), Embedded_Chip (U1.30)
PB11 LED R: Embedded_Chip (U1.31), Embedded_Circuits (Q1.G)
PB12 LED G: Embedded_Chip (U1.32), Embedded_Circuits (Q2.G)
PB13 LED B: Embedded_Chip (U1.33), Embedded_Circuits (Q3.G)
PC8 MOTOR PWM 1: Embedded_System_Top (P6.1), Embedded_Chip (U1.45)
PC9 MOTOR PWM 2: Embedded_System_Top (P6.4), Embedded_Chip (U1.46)
PC10 MOTOR PWM 3: Embedded_System_Top (P6.7), Embedded_Chip (U1.47)
PC11 MOTOR PWM 4: Embedded_System_Top (P6.10), Embedded_Chip (U1.48)
PD11 PNEU UART TX: Embedded_System_Top (R4.1), Embedded_Chip (U1.20)
PD12 PNEU UART RX: Embedded_System_Top (R5.1), Embedded_Chip (U1.21)
PD13 I2C SDA: Embedded_System_Top (P3.2 P5.2), Embedded_Chip (R6.2 U1.22)
PD14 I2C SCL: Embedded_System_Top (P3.3 P5.3), Embedded_Chip (R7.2 U1.23)
PF0 MOTOR PWM 5/TCK: Embedded_System_Top (P6.13), Embedded_Chip (U1.1), Embedded_Circuits (P8.4)
PF1 MOTOR PWM 6/TMS: Embedded_System_Top (P6.16), Embedded_Chip (U1.2), Embedded_Circuits (P8.2)
PF2 MOTOR PWM 7/TDO: Embedded_System_Top (P6.19), Embedded_Chip (U1.3), Embedded_Circuits (P8.6)
PF3 MOTOR PWM 8/TDI: Embedded_System_Top (P6.22), Embedded_Chip (U1.4), Embedded_Circuits (P8.8)
PF4 HYDRO UART TX: Embedded_System_Top (R2.2), Embedded_Chip (U1.5)
PF5 HYDRO UART RX: Embedded_System_Top (R3.2), Embedded_Chip (U1.6)
RST: Embedded_Chip (U1.12), Embedded_Circuits (5 pins)
Vbat: MiniSub_Power_Board (5 pins), 12V_Converter (5 pins), 5V_Converter (C1.2 U2.2), Embedded_System_Top (P2.1), Embedded_Chip (R8.2), Embedded_Circuits (C27.2 U6.1)